# EAGLE design atmega2560 (EAGLE 6.0)
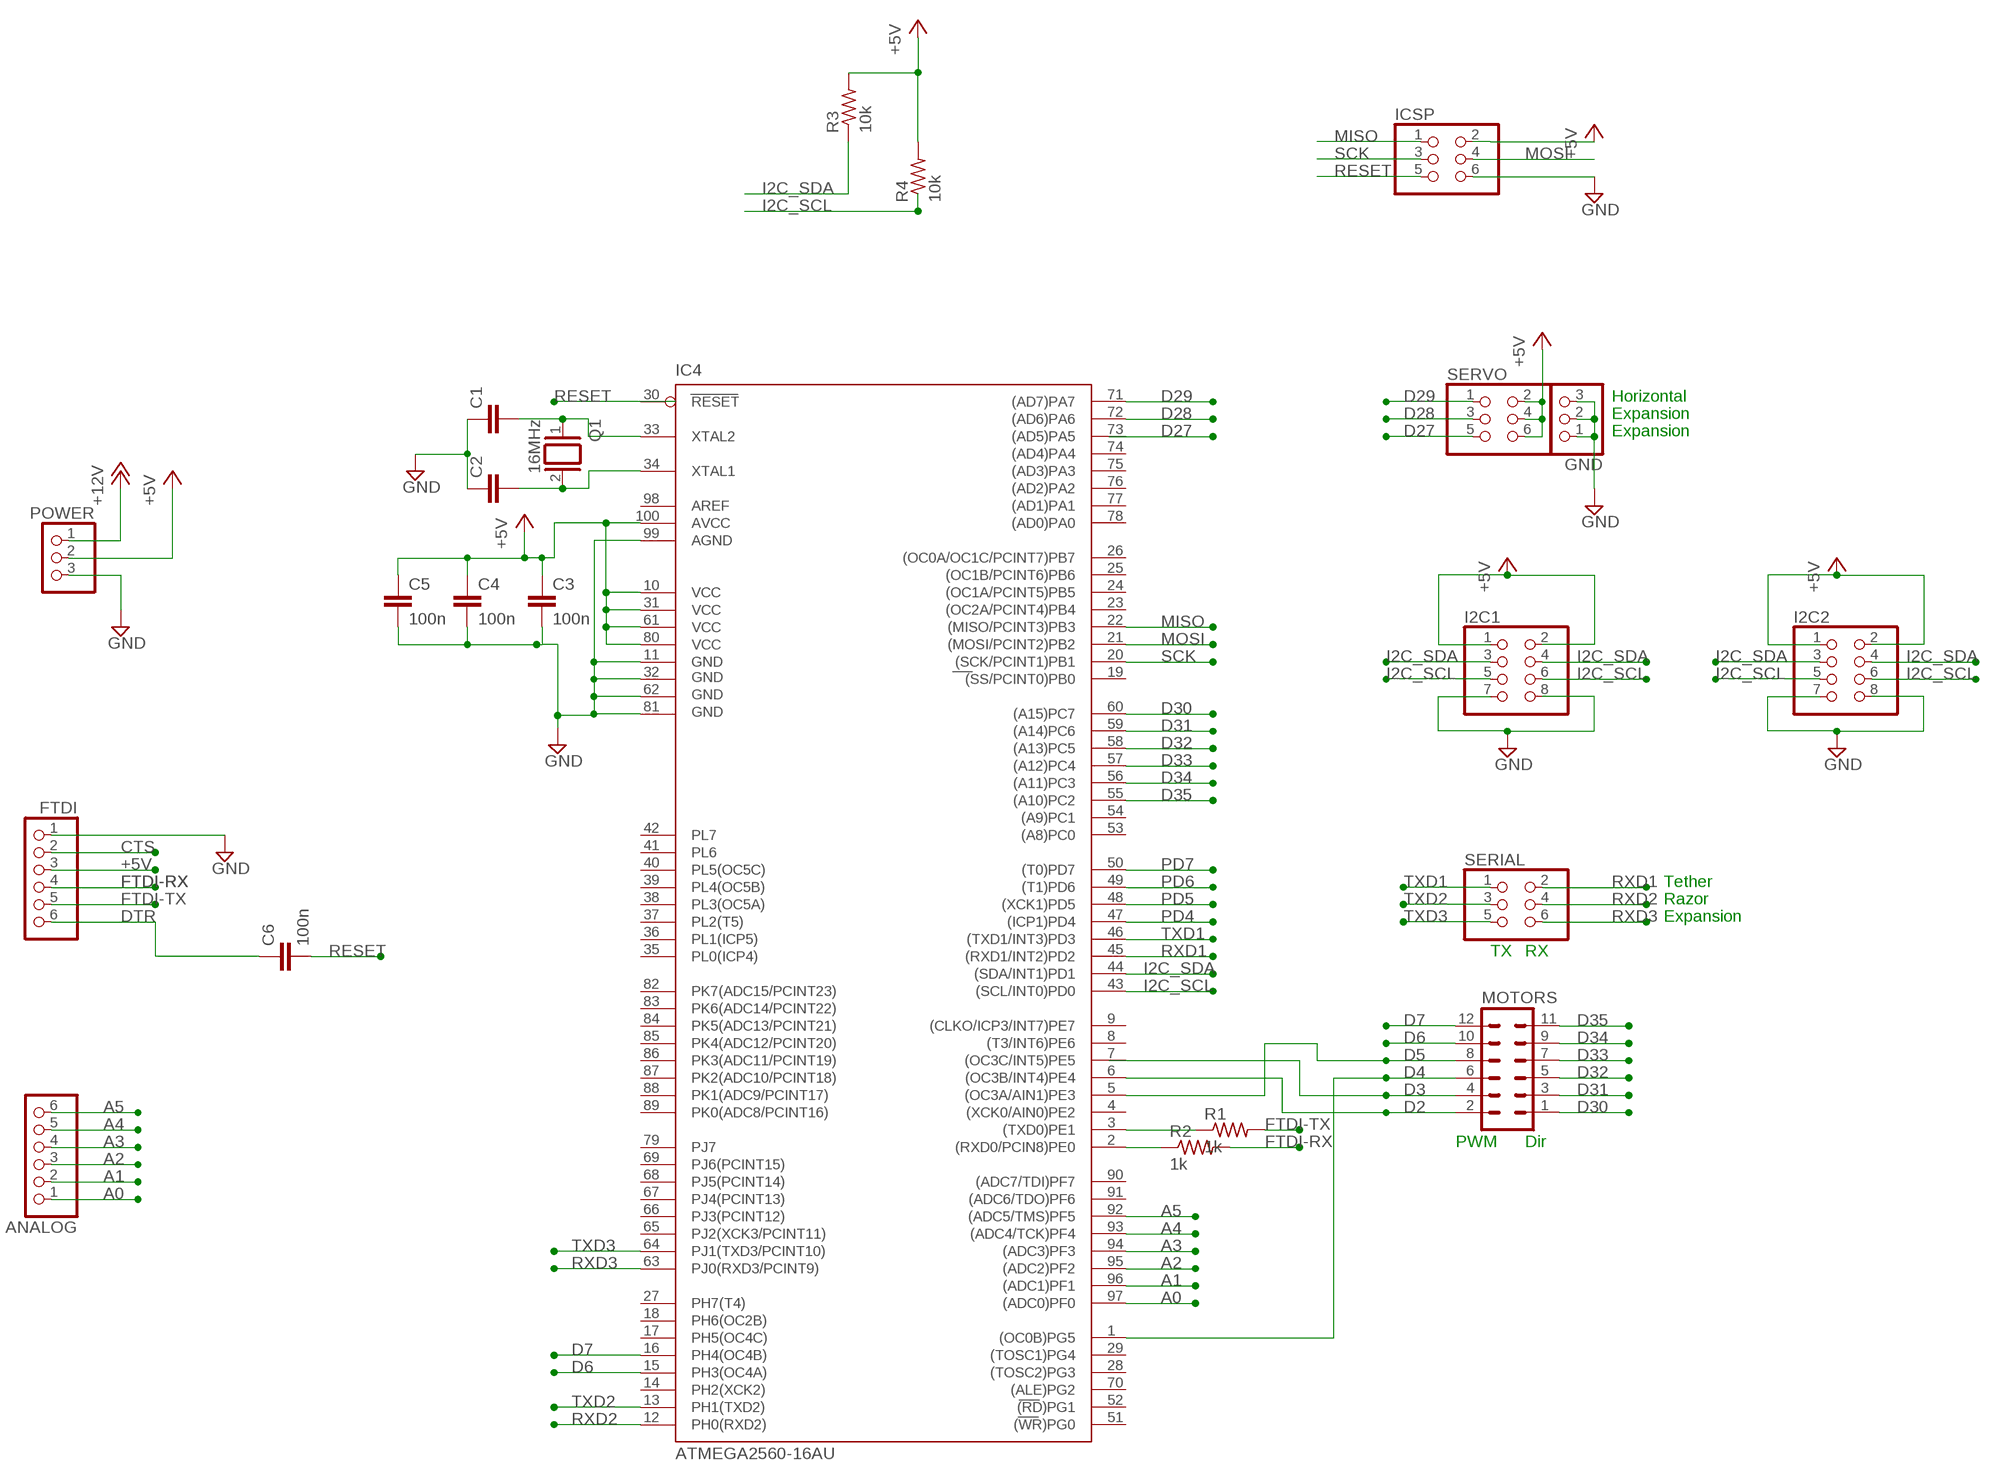
[diagram p0: schematic, sheet 1]

## Parts
ANALOG  PINHD-1X6  [1X06]
C1  C5/3.5  [C5B3.5]
C2  C5/3.5  [C5B3.5]
C3  100n  C5/3.5  [C5B3.5]
C4  100n  C5/3.5  [C5B3.5]
C5  100n  C5/3.5  [C5B3.5]
C6  100n  C-EU050-030X075  [C050-030X075]
FTDI  PINHD-1X6  [1X06]
GND  PINHD-1X3  [1X03]
I2C1  PINHD-2X4  [2X04]
I2C2  PINHD-2X4  [2X04]
IC4  ATMEGA2560-16AU  [TQFP100]
ICSP  PINHD-2X3  [2X03]
MOTORS  MA06-2  [MA06-2]
POWER  PINHD-1X3  [1X03]
Q1  16MHz  XTAL/S  [QS]
R1  1k  R-US_0207/7  [0207/7]
R2  1k  R-US_0207/7  [0207/7]
R3  10k  R-US_0207/7  [0207/7]
R4  10k  R-US_0207/7  [0207/7]
SERIAL  PINHD-2X3  [2X03]
SERVO  PINHD-2X3  [2X03]

## Nets
+5V: C3.1 C4.1 C5.1 FTDI.3 I2C1.1 I2C1.2 I2C2.1 I2C2.2 IC4.10(VCC) IC4.31(VCC1) IC4.61(VCC2) IC4.80(VCC3) IC4.100(AVCC) ICSP.2 POWER.2 R3.2 R4.2 SERVO.2 SERVO.4 SERVO.6
+12V: POWER.1
A0: ANALOG.1 IC4.97((ADC0)PF0)
A1: ANALOG.2 IC4.96((ADC1)PF1)
A2: ANALOG.3 IC4.95((ADC2)PF2)
A3: ANALOG.4 IC4.94((ADC3)PF3)
A4: ANALOG.5 IC4.93((ADC4/TCK)PF4)
A5: ANALOG.6 IC4.92((ADC5/TMS)PF5)
CTS: FTDI.2
D2: IC4.6((OC3B/INT4)PE4) MOTORS.2
D3: MOTORS.4
D4: IC4.1((OC0B)PG5) MOTORS.6
D5: IC4.5((OC3A/AIN1)PE3) MOTORS.8
D6: IC4.15(PH3(OC4A)) MOTORS.10
D7: IC4.16(PH4(OC4B)) MOTORS.12
D27: SERVO.5
D28: IC4.72((AD6)PA6) SERVO.3
D29: IC4.71((AD7)PA7) SERVO.1
D30: IC4.60((A15)PC7) MOTORS.1
D31: IC4.59((A14)PC6) MOTORS.3
D32: IC4.58((A13)PC5) MOTORS.5
D33: IC4.57((A12)PC4) MOTORS.7
D34: IC4.56((A11)PC3) MOTORS.9
D35: IC4.55((A10)PC2) MOTORS.11
DTR: C6.1 FTDI.6
FTDI-RX: FTDI.4 R2.2
FTDI-TX: FTDI.5 R1.2
GND: C1.1 C2.1 C3.2 C4.2 C5.2 FTDI.1 GND.1 GND.2 GND.3 I2C1.7 I2C1.8 I2C2.7 I2C2.8 IC4.11(GND) IC4.32(GND1) IC4.62(GND2) IC4.81(GND3) IC4.99(AGND) ICSP.6 POWER.3
I2C_SCL: I2C1.5 I2C1.6 I2C2.5 I2C2.6 IC4.43((SCL/INT0)PD0) R4.1
I2C_SDA: I2C1.3 I2C1.4 I2C2.3 I2C2.4 IC4.44((SDA/INT1)PD1) R3.1
MISO: IC4.22((MISO/PCINT3)PB3) ICSP.1
MOSI: IC4.21((MOSI/PCINT2)PB2) ICSP.4
N$1: C1.2 IC4.33(XTAL2) Q1.1
N$2: C2.2 IC4.34(XTAL1) Q1.2
N$3: IC4.2((RXD0/PCIN8)PE0) R2.1
N$4: IC4.3((TXD0)PE1) R1.1
PD4: IC4.47((ICP1)PD4)
PD5: IC4.48((XCK1)PD5)
PD6: IC4.49((T1)PD6)
PD7: IC4.50((T0)PD7)
RESET: C6.2 ICSP.5
RXD1: IC4.45((RXD1/INT2)PD2) SERIAL.2
RXD2: IC4.12(PH0(RXD2)) SERIAL.4
RXD3: IC4.63(PJ0(RXD3/PCINT9)) SERIAL.6
SCK: IC4.20((SCK/PCINT1)PB1) ICSP.3
TXD1: IC4.46((TXD1/INT3)PD3) SERIAL.1
TXD2: IC4.13(PH1(TXD2)) SERIAL.3
TXD3: IC4.64(PJ1(TXD3/PCINT10)) SERIAL.5
Unconnected: IC4.4((XCK0/AIN0)PE2) IC4.7((OC3C/INT5)PE5) IC4.8((T3/INT6)PE6) IC4.9((CLKO/ICP3/INT7)PE7) IC4.14(PH2(XCK2)) IC4.17(PH5(OC4C)) IC4.18(PH6(OC2B)) IC4.19((SS/PCINT0)PB0) IC4.23((OC2A/PCINT4)PB4) IC4.24((OC1A/PCINT5)PB5) IC4.25((OC1B/PCINT6)PB6) IC4.26((OC0A/OC1C/PCINT7)PB7) IC4.27(PH7(T4)) IC4.28((TOSC2)PG3) IC4.29((TOSC1)PG4) IC4.30(RESET) IC4.35(PL0(ICP4)) IC4.36(PL1(ICP5)) IC4.37(PL2(T5)) IC4.38(PL3(OC5A)) IC4.39(PL4(OC5B)) IC4.40(PL5(OC5C)) IC4.41(PL6) IC4.42(PL7) IC4.51((WR)PG0) IC4.52((RD)PG1) IC4.53((A8)PC0) IC4.54((A9)PC1) IC4.65(PJ2(XCK3/PCINT11)) IC4.66(PJ3(PCINT12)) IC4.67(PJ4(PCINT13)) IC4.68(PJ5(PCINT14)) IC4.69(PJ6(PCINT15)) IC4.70((ALE)PG2) IC4.73((AD5)PA5) IC4.74((AD4)PA4) IC4.75((AD3)PA3) IC4.76((AD2)PA2) IC4.77((AD1)PA1) IC4.78((AD0)PA0) IC4.79(PJ7) IC4.82(PK7(ADC15/PCINT23)) IC4.83(PK6(ADC14/PCINT22)) IC4.84(PK5(ADC13/PCINT21)) IC4.85(PK4(ADC12/PCINT20)) IC4.86(PK3(ADC11/PCINT19)) IC4.87(PK2(ADC10/PCINT18)) IC4.88(PK1(ADC9/PCINT17)) IC4.89(PK0(ADC8/PCINT16)) IC4.90((ADC7/TDI)PF7) IC4.91((ADC6/TDO)PF6) IC4.98(AREF)

## Notes on the sheet
- Horizontal
- Expansion
- Expansion
- Tether
- Razor
- Expansion
- TX | RX
- PWM | Dir

## Library data of the parts
ANALOG FTDI = pinhead:PINHD-1X6: PIN HEADER
C1-C5 = capacitor-wima:C: CAPACITOR naming: grid - package width
C6 = rcl:C-EU: CAPACITOR, European symbol
GND POWER = pinhead:PINHD-1X3: PIN HEADER
I2C1 I2C2 = pinhead:PINHD-2X4: PIN HEADER
IC4 = atmel-2005:ATMEGA*: MICROCONTROLLER 64/128/256 Kbytes FLASH 4 Kbytes EEPROM 8 Kbytes SRAM 86 General Purpose I/O pins 12-channels16-bit PWM 4 x Serial USARTs 16-channels 10-bit A/D
ICSP SERIAL SERVO = pinhead:PINHD-2X3: PIN HEADER
MOTORS = con-lstb:MA06-2: PIN HEADER; OC_FARNELL: unknown; OC_NEWARK: unknown
Q1 = special:XTAL/S: CRYSTAL
R1-R4 = resistor:R-US_: RESISTOR, American symbol

## Board
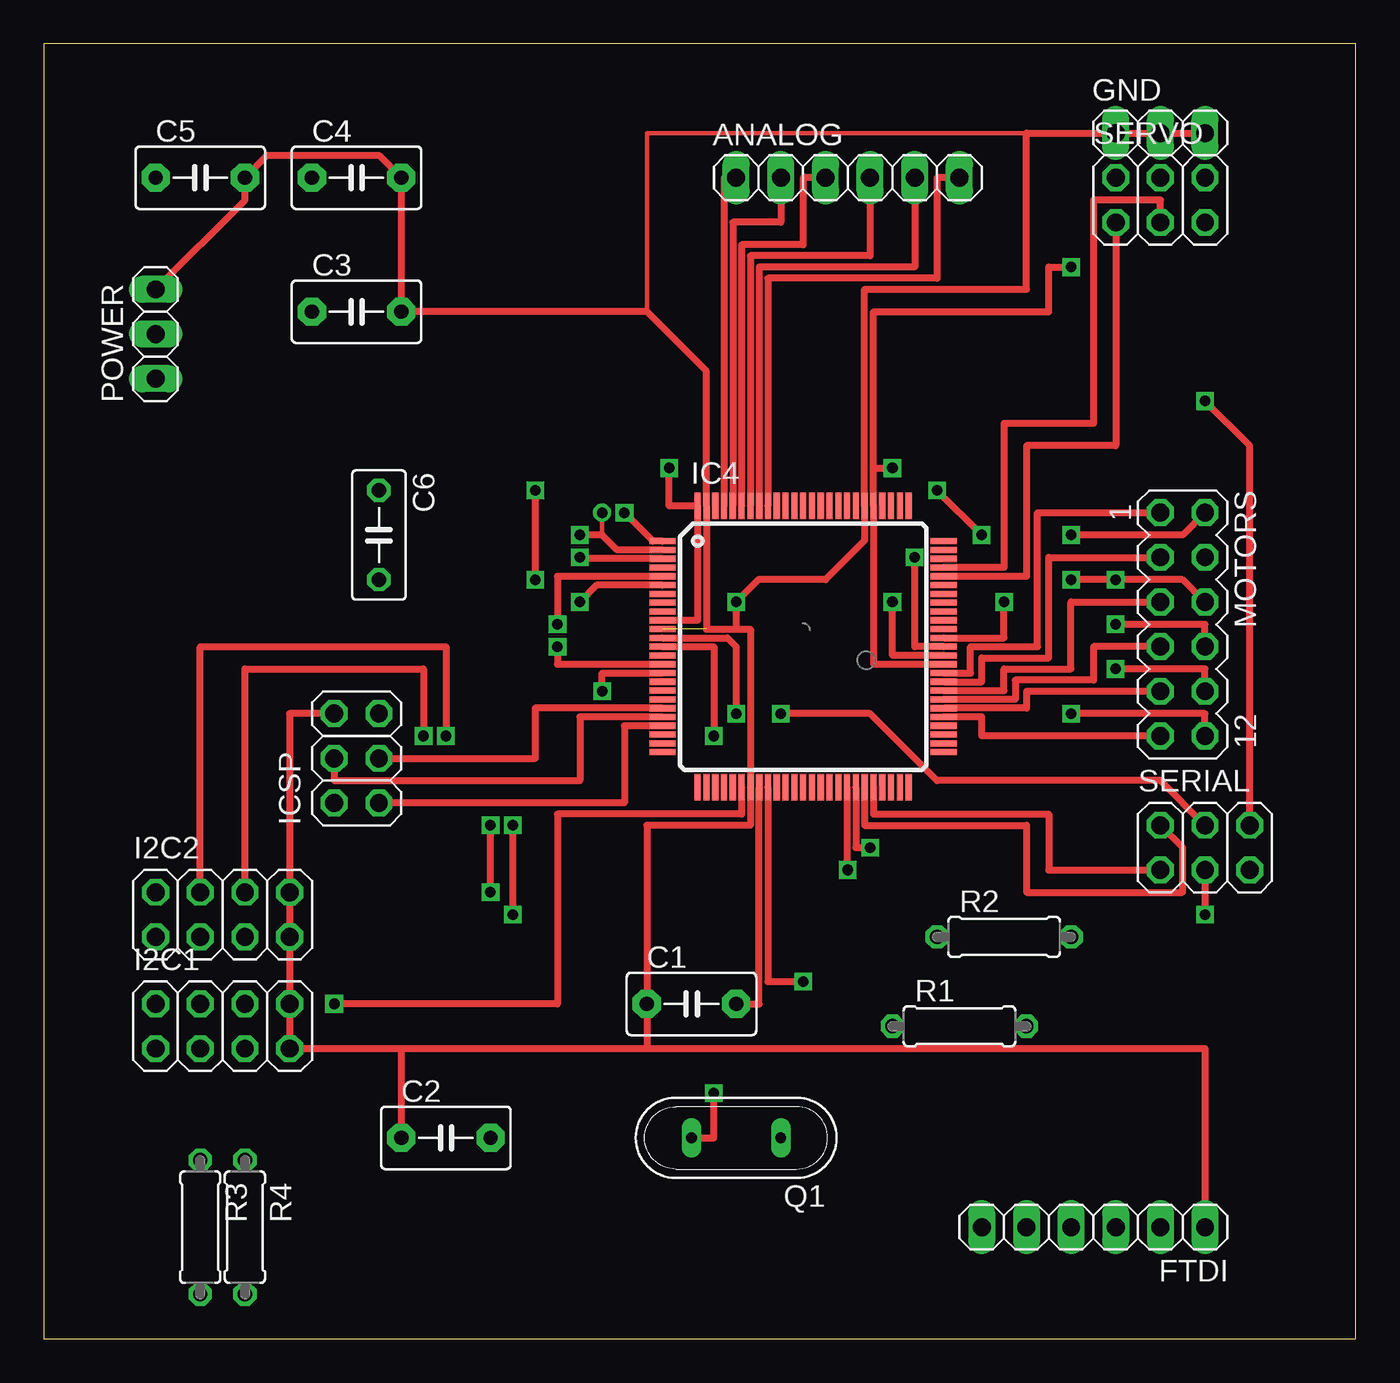
[diagram p1: board, top side]
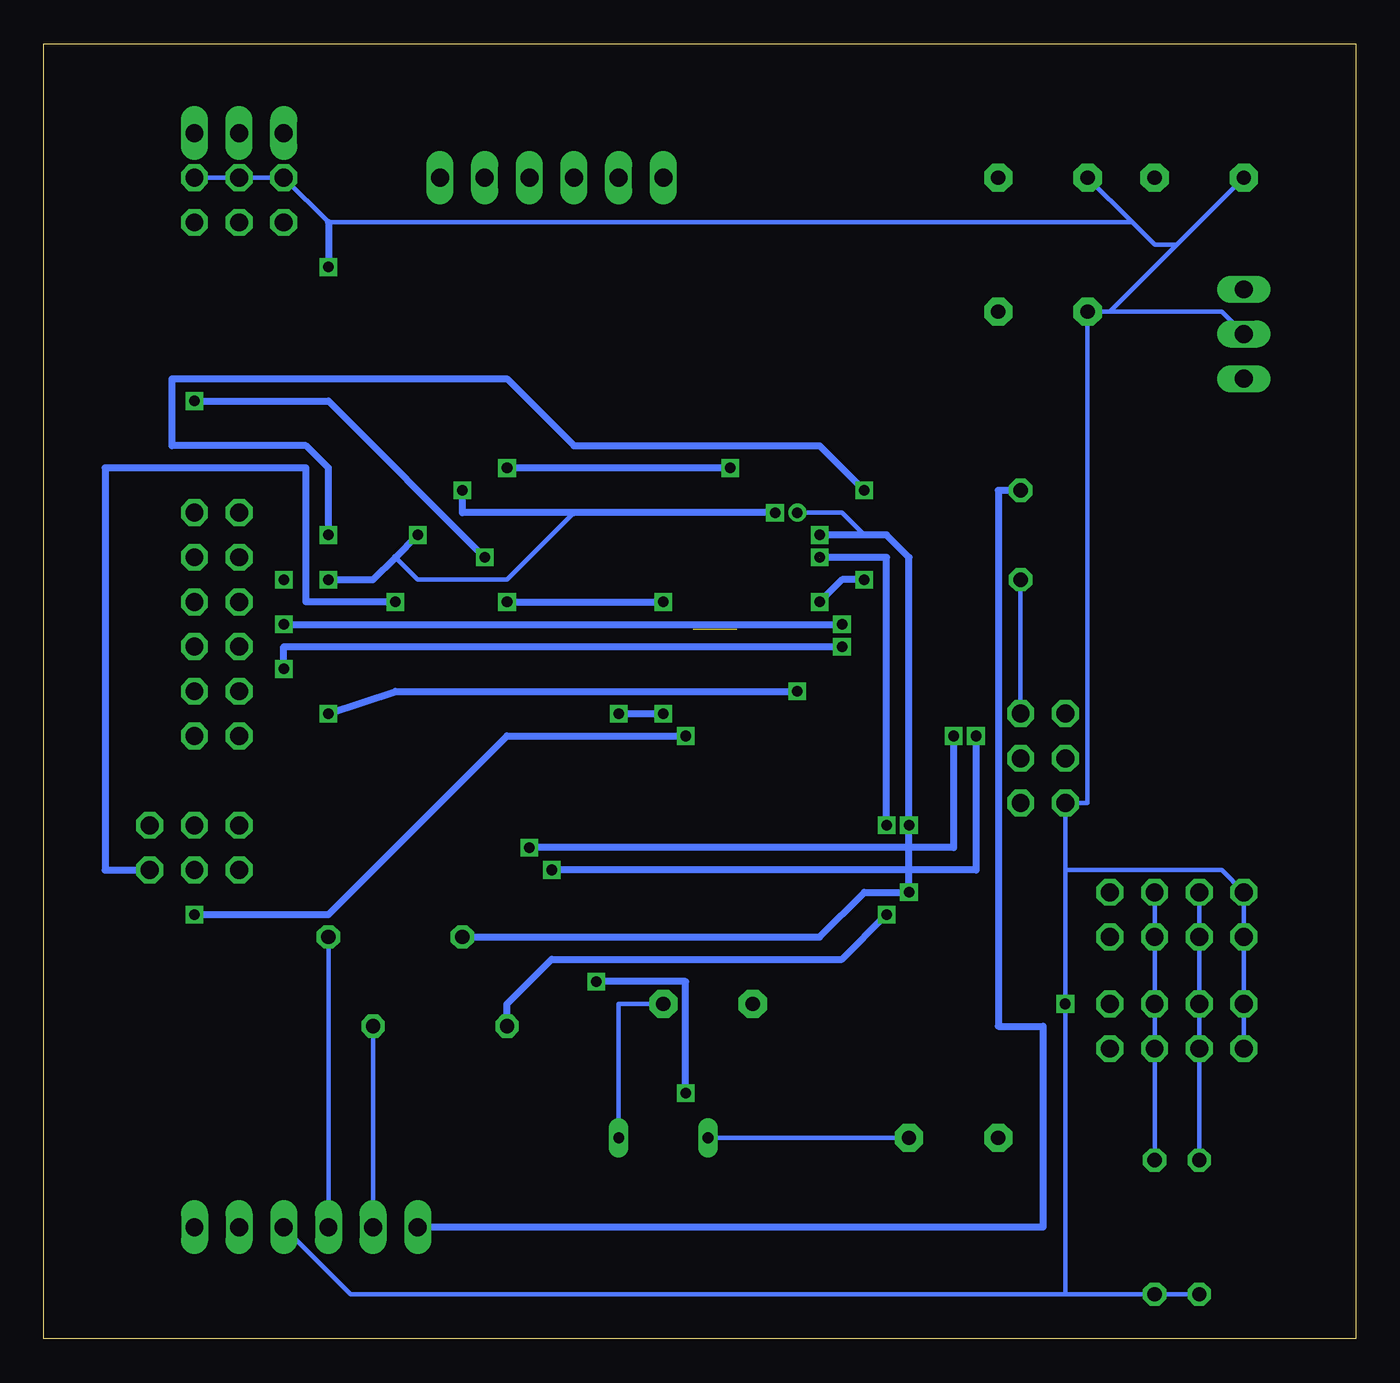
[diagram p2: board, bottom side, seen from below]

Size 74.6 x 73.65 mm. Coordinates in mm from the lower left corner, seen from the top.
Outline: 0,0 74.6,0 74.6,73.65 0,73.65 0,0
Copper layers (1*16): Top 0.035mm / dielectric 1.5mm / Bottom 0.035mm
Design rules: minimum track width 10mil, minimum drill 24mil, track to track 8mil, track to pad 8mil, pad to pad 8mil, via to via 8mil, smd to smd 8mil, copper to edge 40mil, drill to drill 8mil, minimum pad ring 10mil, minimum via ring 8mil, stop-mask expansion 4mil, vias tented up to drill 0mil, thermal gap 10mil

### Footprints (pad centres in the part's own frame; a part is rotated, then mirrored left to right if it is on the bottom)
1X06 = drill 1.016 long: 1 -6.35,0; 2 -3.81,0; 3 -1.27,0; 4 1.27,0; 5 3.81,0; 6 6.35,0
C5B3.5 = drill 0.813 pad 1.6 octagon: 1 -2.54,0; 2 2.54,0
C050-030X075 = drill 0.813 octagon: 1 -2.54,0; 2 2.54,0
1X03 = drill 1.016 long: 1 -2.54,0; 2 0,0; 3 2.54,0
2X04 = drill 1.016 octagon: 1 -3.81,-1.27; 2 -3.81,1.27; 3 -1.27,-1.27; 4 -1.27,1.27; 5 1.27,-1.27; 6 1.27,1.27; 7 3.81,-1.27; 8 3.81,1.27
TQFP100 = smd 1.5 x 0.35: 1 -8,6; 2 -8,5.5; 3 -8,5; 4 -8,4.5; 5 -8,4; 6 -8,3.5; 7 -8,3; 8 -8,2.5; 9 -8,2; 10 -8,1.5; 11 -8,1; 12 -8,0.5; 13 -8,0; 14 -8,-0.5; 15 -8,-1; 16 -8,-1.5; 17 -8,-2; 18 -8,-2.5; 19 -8,-3; 20 -8,-3.5; 21 -8,-4; 22 -8,-4.5; 23 -8,-5; 24 -8,-5.5; 25 -8,-6; 51 8,-6; 52 8,-5.5; 53 8,-5; 54 8,-4.5; 55 8,-4; 56 8,-3.5; 57 8,-3; 58 8,-2.5; 59 8,-2; 60 8,-1.5; 61 8,-1; 62 8,-0.5; 63 8,0; 64 8,0.5; 65 8,1; 66 8,1.5; 67 8,2; 68 8,2.5; 69 8,3; 70 8,3.5; 71 8,4; 72 8,4.5; 73 8,5; 74 8,5.5; 75 8,6 | smd 0.35 x 1.5: 26 -6,-8; 27 -5.5,-8; 28 -5,-8; 29 -4.5,-8; 30 -4,-8; 31 -3.5,-8; 32 -3,-8; 33 -2.5,-8; 34 -2,-8; 35 -1.5,-8; 36 -1,-8; 37 -0.5,-8; 38 0,-8; 39 0.5,-8; 40 1,-8; 41 1.5,-8; 42 2,-8; 43 2.5,-8; 44 3,-8; 45 3.5,-8; 46 4,-8; 47 4.5,-8; 48 5,-8; 49 5.5,-8; 50 6,-8; 76 6,8; 77 5.5,8; 78 5,8; 79 4.5,8; 80 4,8; 81 3.5,8; 82 3,8; 83 2.5,8; 84 2,8; 85 1.5,8; 86 1,8; 87 0.5,8; 88 0,8; 89 -0.5,8; 90 -1,8; 91 -1.5,8; 92 -2,8; 93 -2.5,8; 94 -3,8; 95 -3.5,8; 96 -4,8; 97 -4.5,8; 98 -5,8; 99 -5.5,8; 100 -6,8
2X03 = drill 1.016 octagon: 1 -2.54,-1.27; 2 -2.54,1.27; 3 0,-1.27; 4 0,1.27; 5 2.54,-1.27; 6 2.54,1.27
MA06-2 = drill 1.016 octagon: 1 -6.35,-1.27; 2 -6.35,1.27; 3 -3.81,-1.27; 4 -3.81,1.27; 5 -1.27,-1.27; 6 -1.27,1.27; 7 1.27,-1.27; 8 1.27,1.27; 9 3.81,-1.27; 10 3.81,1.27; 11 6.35,-1.27; 12 6.35,1.27
QS = drill 0.61 long: 1 -2.54,0; 2 2.54,0
0207/7 = drill 0.813 octagon: 1 -3.81,0; 2 3.81,0

### Placement (x,y rotation side)
ANALOG  45.72,66.04 0 top
C1  36.83,19.05 0 top
C2  22.86,11.43 0 top
C3  17.78,58.42 0 top
C4  17.78,66.04 0 top
C5  8.89,66.04 0 top
C6  19.05,45.72 270 top
FTDI  59.69,6.35 180 top
GND  63.5,68.58 0 top
I2C1  10.16,17.78 0 top
I2C2  10.16,24.13 0 top
IC4  43.18,39.37 0 top
ICSP  17.78,33.02 90 top
MOTORS  64.77,40.64 270 top
POWER  6.35,57.15 90 top
Q1  39.37,11.43 180 top
R1  52.07,17.78 0 top
R2  54.61,22.86 0 top
R3  8.89,6.35 270 top
R4  11.43,6.35 270 top
SERIAL  66.04,27.94 0 top
SERVO  63.5,64.77 0 top

### Tracks (layer width: path | path; a pad name or v marks a point on that pad's centre or on a via)
+5V  (via drill 0.6)
  Top 0.406: 47.18,49.53 IC4.80 47.18,38.37 IC4.61 | 47.18,49.53 47.18,58.42 57.15,58.42 57.15,60.96 v58.42,60.96 | IC4.10 37.18,40.87 IC4.100 35.56,47.37 v35.56,49.53 | 47.18,49.53 v48.26,49.53 | IC4.31 39.68,29.84 29.21,29.84 29.21,19.05 v16.51,19.05
  Bottom 0.254: SERVO.6 SERVO.4 SERVO.2 58.42,63.5 12.7,63.5 | POWER.2 7.62,58.42 13.97,58.42 | 13.97,58.42 C3.1 15.24,30.48 ICSP.2 16.51,26.67 | 13.97,58.42 10.16,62.23 | 10.16,62.23 C5.1 | 12.7,63.5 11.43,62.23 10.16,62.23 | 12.7,63.5 C4.1 | I2C1.1 I2C1.2 I2C2.1 I2C2.2 7.62,26.67 16.51,26.67 | R3.2 R4.2 16.51,2.54 | FTDI.3 57.15,2.54 16.51,2.54 | 16.51,2.54 v16.51,19.05 16.51,26.67
  Bottom 0.406: 58.42,63.5 v58.42,60.96 | v35.56,49.53 v48.26,49.53
A0
  Top 0.406: ANALOG.1 38.68,66.04 IC4.97
A1
  Top 0.406: ANALOG.2 41.91,63.5 39.18,63.5 IC4.96
A2
  Top 0.406: ANALOG.3 43.18,66.04 43.18,62.23 39.68,62.23 IC4.95
A3
  Top 0.406: ANALOG.4 46.99,61.59 40.18,61.59 IC4.94
A4
  Top 0.406: ANALOG.5 49.53,60.96 40.68,60.96 IC4.93
A5
  Top 0.406: ANALOG.6 50.8,66.04 50.8,60.32 41.18,60.32 IC4.92
D2  (via drill 0.6)
  Top 0.406: MOTORS.2 64.77,45.72 v58.42,45.72 | v27.94,48.26 v27.94,43.18 | IC4.6 31.44,42.87 v30.48,41.91
  Bottom 0.406: v58.42,45.72 58.42,49.53 59.69,50.8 67.31,50.8 67.31,54.61 48.26,54.61 44.45,50.8 30.48,50.8 v27.94,48.26 | v27.94,43.18 29.21,43.18 v30.48,41.91
D4  (via drill 0.6)
  Top 0.406: MOTORS.6 64.77,43.18 v60.96,43.18 v58.42,43.18 | IC4.1 34.64,45.37 v33.02,46.99 | v50.8,48.26 53.34,45.72
  Bottom 0.254: 54.61,44.45 53.34,43.18 48.26,43.18 44.45,46.99
  Bottom 0.406: v33.02,46.99 44.45,46.99 50.8,46.99 v50.8,48.26 | v58.42,43.18 55.88,43.18 54.61,44.45 53.34,45.72
D5  (via drill 0.6)
  Top 0.406: MOTORS.8 66.04,40.64 v60.96,40.64 | IC4.5 29.21,43.37 v29.21,40.64
  Bottom 0.406: v60.96,40.64 v29.21,40.64
D6  (via drill 0.6)
  Top 0.406: MOTORS.10 66.04,38.1 v60.96,38.1 | v29.21,39.37 29.21,38.37 IC4.15
  Bottom 0.406: v60.96,38.1 60.96,39.37 v29.21,39.37
D7  (via drill 0.6)
  Top 0.406: MOTORS.12 66.04,35.56 v58.42,35.56 | v31.75,36.83 31.75,37.87 IC4.16
  Bottom 0.406: v58.42,35.56 54.61,36.83 v31.75,36.83
D28
  Top 0.406: SERVO.3 63.5,64.77 59.69,64.77 59.69,52.07 54.61,52.07 54.61,43.87 IC4.72
D29
  Top 0.406: SERVO.1 60.96,50.8 55.88,50.8 55.88,43.37 IC4.71
D30
  Top 0.406: IC4.60 52.7,37.87 52.7,39.37 56.52,39.37 56.52,46.99 MOTORS.1
D31
  Top 0.406: IC4.59 53.34,37.37 53.34,38.73 57.15,38.73 57.15,44.45 MOTORS.3
D32
  Top 0.406: IC4.58 54.61,36.87 54.61,38.1 58.42,38.1 58.42,41.91 MOTORS.5
D33
  Top 0.406: MOTORS.7 59.69,39.37 59.69,37.46 55.24,37.46 55.24,36.37 IC4.57
D34
  Top 0.406: MOTORS.9 55.88,36.83 55.88,35.87 IC4.56
D35
  Top 0.406: MOTORS.11 53.34,34.29 53.34,35.37 IC4.55
DTR
  Bottom 0.406: C6.1 20.32,48.26 20.32,17.78 17.78,17.78 17.78,6.35 FTDI.6
FTDI-RX
  Bottom 0.254: FTDI.4 R2.2
FTDI-TX
  Bottom 0.254: FTDI.5 R1.2
GND  (via drill 0.6)  (1 unrouted)
  Top 0.254: 55.88,68.58 34.29,68.58 34.29,58.42
  Top 0.406: POWER.3 11.43,64.77 C5.2 12.7,67.31 19.05,67.31 C4.2 C3.2 34.29,58.42 37.68,55.03 IC4.99 37.68,40.37 40.18,40.37 IC4.32 40.18,29.21 34.29,29.21 C1.1 34.29,16.51 | ICSP.6 13.97,35.56 I2C2.8 I2C2.7 I2C1.8 I2C1.7 20.32,16.51 | 20.32,16.51 C2.1 | 20.32,16.51 34.29,16.51 | 34.29,16.51 66.04,16.51 FTDI.1 | GND.3 GND.2 GND.1 55.88,68.58 55.88,59.69 46.68,59.69 IC4.81 46.68,45.41 44.45,43.18 40.64,43.18 v39.37,41.91 39.37,40.64 | IC4.62 48.26,38.87 v48.26,41.91
  Bottom 0.406: v48.26,41.91 v39.37,41.91
I2C_SCL  (via drill 0.6)
  Top 0.406: I2C2.6 11.43,38.1 21.59,38.1 v21.59,34.29 | IC4.43 45.68,26.67 v45.72,26.67
  Bottom 0.254: I2C2.6 I2C2.5 I2C1.6 I2C1.5 R4.1
  Bottom 0.406: v21.59,34.29 21.59,26.67 v45.72,26.67
I2C_SDA  (via drill 0.6)
  Top 0.406: I2C2.4 8.89,39.37 22.86,39.37 v22.86,34.29 | IC4.44 46.18,27.94 v46.99,27.94
  Bottom 0.254: I2C2.4 I2C2.3 I2C1.4 I2C1.3 R3.1
  Bottom 0.406: v22.86,34.29 22.86,27.94 v46.99,27.94
MISO
  Top 0.406: IC4.22 33.02,34.87 33.02,30.48 ICSP.1
MOSI
  Top 0.406: ICSP.4 16.51,31.75 30.48,31.75 30.48,35.37 IC4.21
N$1
  Top 0.406: C1.2 40.68,19.05 IC4.33
  Bottom 0.254: Q1.1 41.91,19.05 C1.2
N$2  (via drill 0.6)
  Top 0.406: Q1.2 38.1,11.43 v38.1,13.97 | IC4.34 41.18,20.32 v43.18,20.32
  Bottom 0.254: C2.2 Q1.2
  Bottom 0.406: v38.1,13.97 38.1,20.32 v43.18,20.32
N$3  (via drill 0.6, 0.61)
  Top 0.254: v31.75,46.99 31.75,45.72
  Top 0.406: IC4.2 32.6,44.87 31.75,45.72 30.48,45.72 | v25.4,25.4 v25.4,29.21
  Bottom 0.254: v31.75,46.99 29.21,46.99 27.94,45.72
  Bottom 0.406: R2.1 30.48,22.86 27.94,25.4 v25.4,25.4 25.4,44.45 26.67,45.72 27.94,45.72 30.48,45.72
N$4  (via drill 0.6)  (1 unrouted)
  Top 0.406: IC4.3 30.56,44.37 arc-90 30.48,44.45 | v26.67,24.13 v26.67,29.21
  Bottom 0.406: R1.1 48.26,19.05 45.72,21.59 29.21,21.59 v26.67,24.13 | v26.67,29.21 26.67,44.45 30.48,44.45
N$5  (via drill 0.6)
  other vias: 30.48,45.72
N$6  (via drill 0.6)
  other vias: 30.48,44.45
N$7  (via drill 0.6)
  other vias: 53.34,45.72
RESET
  Bottom 0.254: ICSP.5 C6.2
RXD1
  Top 0.406: IC4.45 46.68,29.21 55.88,29.21 55.88,25.4 64.77,25.4 64.77,27.94 SERIAL.2
RXD2  (via drill 0.6)
  Top 0.406: SERIAL.4 63.5,31.75 50.8,31.75 46.99,35.56 v41.91,35.56 | IC4.12 38.87,39.87 39.37,39.37 v39.37,35.56
  Bottom 0.406: v41.91,35.56 v39.37,35.56
RXD3  (via drill 0.6)
  Top 0.406: IC4.63 49.53,39.37 v49.53,44.45 | SERIAL.6 68.58,50.8 v66.04,53.34
  Bottom 0.406: v66.04,53.34 58.42,53.34 v49.53,44.45
SCK
  Top 0.406: ICSP.3 27.94,33.02 27.94,35.87 IC4.20
TXD1
  Top 0.406: IC4.46 47.18,29.84 57.15,29.84 57.15,26.67 SERIAL.1
TXD2  (via drill 0.6)
  Top 0.406: SERIAL.3 v66.04,24.13 | IC4.13 38.1,39.37 v38.1,34.29
  Bottom 0.406: v66.04,24.13 58.42,24.13 48.26,34.29 v38.1,34.29
TXD3  (via drill 0.6)
  Top 0.406: IC4.64 54.61,39.87 v54.61,41.91
  Bottom 0.406: v54.61,41.91 59.69,41.91 59.69,49.53 71.12,49.53 71.12,26.67 SERIAL.5